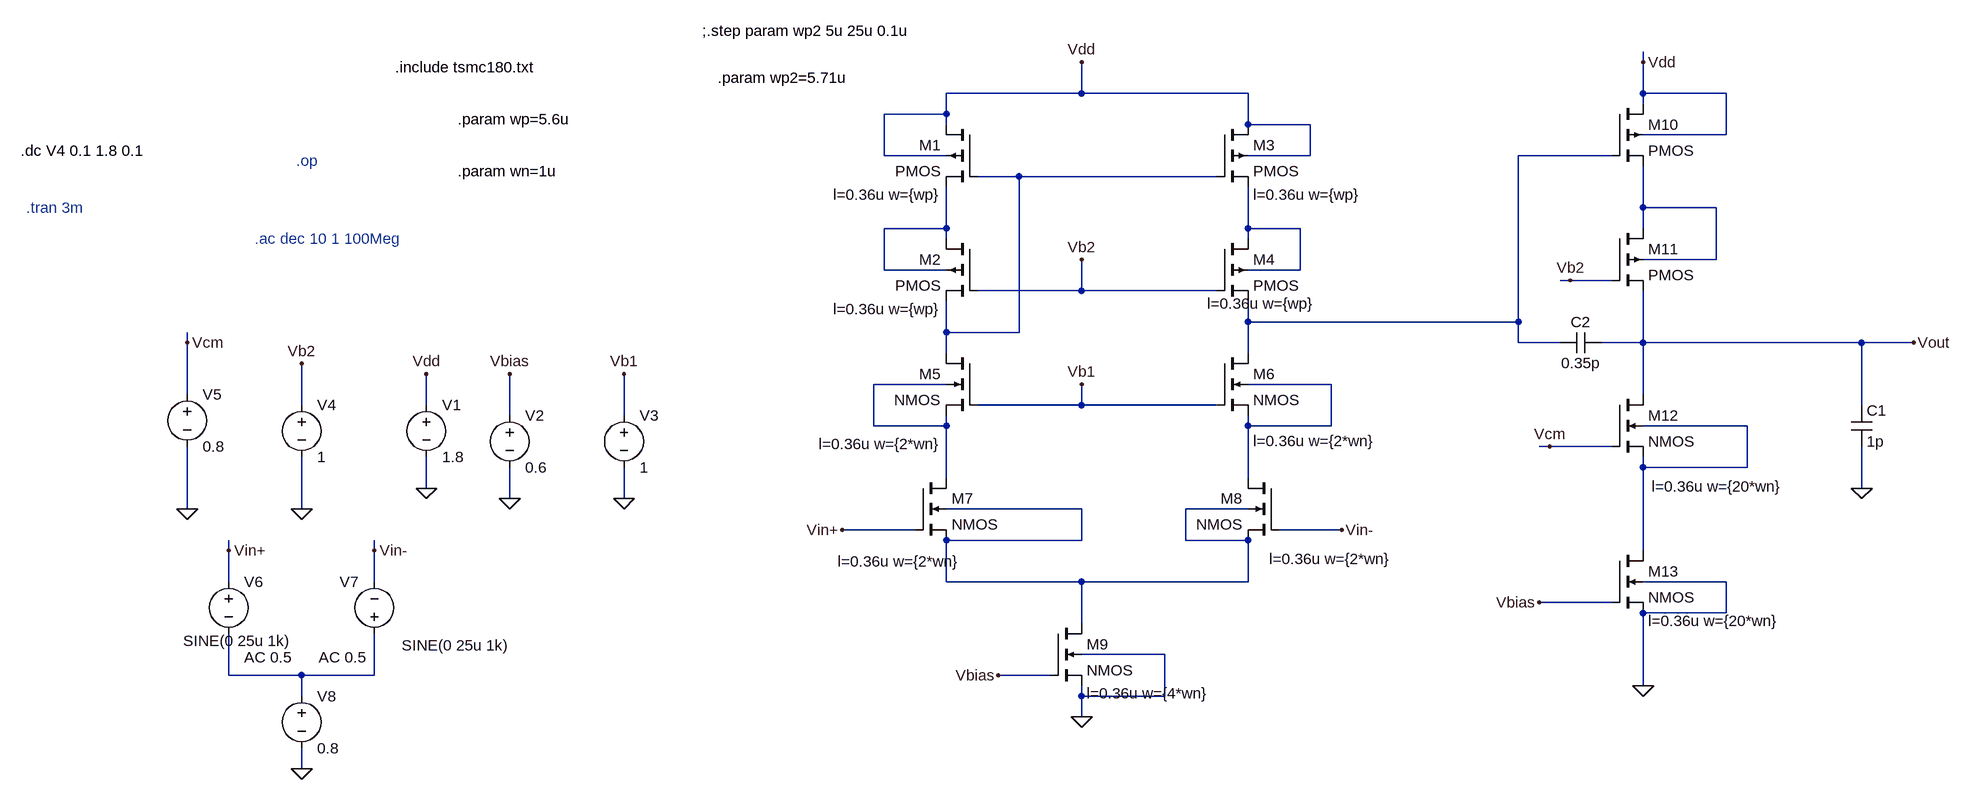
[diagram p0: schematic Fully differential telescopic cascode op-amp.asc]
Fully differential telescopic cascode op-amp.asc, the LTspice schematic file:
Version 4
SHEET 1 1580 680
WIRE 1072 -544 1072 -560
WIRE 208 -496 208 -544
WIRE 208 -496 0 -496
WIRE 464 -496 208 -496
WIRE 1072 -496 1072 -544
WIRE 1200 -496 1072 -496
WIRE 1072 -480 1072 -496
WIRE 0 -464 0 -496
WIRE 0 -464 -96 -464
WIRE 0 -448 0 -464
WIRE 464 -448 464 -496
WIRE 560 -448 464 -448
WIRE 1200 -432 1200 -496
WIRE 1200 -432 1072 -432
WIRE -96 -400 -96 -464
WIRE 0 -400 -96 -400
WIRE 560 -400 560 -448
WIRE 560 -400 464 -400
WIRE 1024 -400 880 -400
WIRE 112 -368 48 -368
WIRE 416 -368 112 -368
WIRE 1072 -320 1072 -384
WIRE 1184 -320 1072 -320
WIRE 0 -288 0 -352
WIRE 0 -288 -96 -288
WIRE 464 -288 464 -352
WIRE 544 -288 464 -288
WIRE 1072 -288 1072 -320
WIRE 0 -272 0 -288
WIRE 464 -272 464 -288
WIRE 1184 -240 1184 -320
WIRE 1184 -240 1072 -240
WIRE -96 -224 -96 -288
WIRE 0 -224 -96 -224
WIRE 544 -224 544 -288
WIRE 544 -224 464 -224
WIRE 960 -208 944 -208
WIRE 1024 -208 960 -208
WIRE 208 -192 208 -240
WIRE 208 -192 48 -192
WIRE 416 -192 208 -192
WIRE 464 -144 464 -176
WIRE 880 -144 880 -400
WIRE 880 -144 464 -144
WIRE 0 -128 0 -176
WIRE 112 -128 112 -368
WIRE 112 -128 0 -128
WIRE -1168 -112 -1168 -128
WIRE 880 -112 880 -144
WIRE 944 -112 880 -112
WIRE 1072 -112 1072 -192
WIRE 1072 -112 1008 -112
WIRE 1408 -112 1072 -112
WIRE 1488 -112 1408 -112
WIRE 0 -96 0 -128
WIRE 464 -96 464 -144
WIRE 0 -48 -112 -48
WIRE 592 -48 464 -48
WIRE -1168 -32 -1168 -112
WIRE 1072 -32 1072 -112
WIRE -992 -16 -992 -80
WIRE -800 -16 -800 -64
WIRE 208 -16 208 -48
WIRE 208 -16 48 -16
WIRE 416 -16 208 -16
WIRE 1408 -16 1408 -112
WIRE -672 0 -672 -64
WIRE -496 0 -496 -64
WIRE -112 16 -112 -48
WIRE 0 16 0 0
WIRE 0 16 -112 16
WIRE 464 16 464 0
WIRE 592 16 592 -48
WIRE 592 16 464 16
WIRE 1232 16 1072 16
WIRE 928 48 912 48
WIRE 1024 48 928 48
WIRE 1072 80 1072 64
WIRE 1232 80 1232 16
WIRE 1232 80 1072 80
WIRE 0 96 0 16
WIRE 464 96 464 16
WIRE -800 112 -800 64
WIRE 1408 112 1408 48
WIRE -672 128 -672 80
WIRE -496 128 -496 80
WIRE -1168 144 -1168 48
WIRE -992 144 -992 64
WIRE 208 144 0 144
WIRE 464 144 368 144
WIRE -48 176 -160 176
WIRE 608 176 512 176
WIRE 208 192 208 144
WIRE 208 192 0 192
WIRE 368 192 368 144
WIRE 464 192 368 192
WIRE -1104 208 -1104 192
WIRE -880 208 -880 192
WIRE 1072 208 1072 80
WIRE -1104 256 -1104 208
WIRE -880 256 -880 208
WIRE 0 256 0 192
WIRE 208 256 0 256
WIRE 464 256 464 192
WIRE 464 256 208 256
WIRE 1200 256 1072 256
WIRE 1024 288 912 288
WIRE 1200 304 1200 256
WIRE 1200 304 1072 304
WIRE 208 320 208 256
WIRE 336 368 208 368
WIRE -1104 400 -1104 336
WIRE -992 400 -1104 400
WIRE -880 400 -880 336
WIRE -880 400 -992 400
WIRE 160 400 80 400
WIRE 1072 416 1072 304
WIRE -992 432 -992 400
WIRE 208 432 208 416
WIRE 336 432 336 368
WIRE 336 432 208 432
WIRE 208 464 208 432
WIRE -992 544 -992 512
FLAG 208 464 0
FLAG 80 400 Vbias
FLAG -160 176 Vin+
FLAG 608 176 Vin-
FLAG 208 -544 Vdd
FLAG -672 128 0
FLAG -800 112 0
FLAG -800 -64 Vdd
FLAG -672 -64 Vbias
FLAG -496 128 0
FLAG -496 -64 Vb1
FLAG 208 -48 Vb1
FLAG -992 144 0
FLAG -992 -80 Vb2
FLAG 208 -240 Vb2
FLAG -1168 144 0
FLAG -1168 -112 Vcm
FLAG -992 544 0
FLAG -1104 208 Vin+
FLAG -880 208 Vin-
FLAG 1072 416 0
FLAG 912 288 Vbias
FLAG 1408 112 0
FLAG 1488 -112 Vout
FLAG 960 -208 Vb2
FLAG 1072 -544 Vdd
FLAG 928 48 Vcm
DATAFLAG 1184 -112 ""
DATAFLAG 736 -144 ""
SYMBOL pmos4 48 -448 M0
WINDOW 123 56 108 Left 2
SYMATTR Value2 l=0.36u w={wp}
SYMATTR InstName M1
SYMBOL pmos4 48 -272 M0
WINDOW 123 56 108 Left 2
SYMATTR Value2 l=0.36u w={wp}
SYMATTR InstName M2
SYMBOL pmos4 416 -448 R0
WINDOW 123 56 108 Left 2
SYMATTR Value2 l=0.36u w={wp}
SYMATTR InstName M3
SYMBOL pmos4 416 -272 R0
WINDOW 123 -15 100 Left 2
SYMATTR Value2 l=0.36u w={wp}
SYMATTR InstName M4
SYMBOL nmos4 48 -96 M0
WINDOW 123 56 140 Left 2
SYMATTR Value2 l=0.36u w={2*wn}
SYMATTR InstName M5
SYMBOL nmos4 416 -96 R0
WINDOW 123 56 135 Left 2
SYMATTR Value2 l=0.36u w={2*wn}
SYMATTR InstName M6
SYMBOL nmos4 -48 96 R0
WINDOW 123 -119 129 Left 2
SYMATTR Value2 l=0.36u w={2*wn}
SYMATTR InstName M7
SYMBOL nmos4 512 96 M0
WINDOW 123 -173 125 Left 2
SYMATTR Value2 l=0.36u w={2*wn}
SYMATTR InstName M8
SYMBOL nmos4 160 320 R0
WINDOW 123 56 108 Left 2
SYMATTR Value2 l=0.36u w={4*wn}
SYMATTR InstName M9
SYMBOL voltage -800 -32 R0
WINDOW 123 0 0 Left 0
WINDOW 39 0 0 Left 0
SYMATTR InstName V1
SYMATTR Value 1.8
SYMBOL voltage -672 -16 R0
WINDOW 123 0 0 Left 0
WINDOW 39 0 0 Left 0
SYMATTR InstName V2
SYMATTR Value 0.6
SYMBOL voltage -496 -16 R0
WINDOW 123 0 0 Left 0
WINDOW 39 0 0 Left 0
SYMATTR InstName V3
SYMATTR Value 1
SYMBOL voltage -992 -32 R0
WINDOW 123 0 0 Left 0
WINDOW 39 0 0 Left 0
SYMATTR InstName V4
SYMATTR Value 1
SYMBOL voltage -1168 -48 R0
WINDOW 123 0 0 Left 0
WINDOW 39 0 0 Left 0
SYMATTR InstName V5
SYMATTR Value 0.8
SYMBOL voltage -1104 240 R0
WINDOW 3 266 114 Left 2
WINDOW 123 24 132 Left 2
WINDOW 39 0 0 Left 0
SYMATTR Value SINE(0 25u 1k)
SYMATTR Value2 AC 0.5
SYMATTR InstName V6
SYMBOL voltage -880 352 R180
WINDOW 0 24 96 Left 2
WINDOW 3 129 5 Left 2
WINDOW 123 12 -20 Left 2
WINDOW 39 0 0 Left 0
SYMATTR InstName V7
SYMATTR Value SINE(0 25u 1k)
SYMATTR Value2 AC 0.5
SYMBOL voltage -992 416 R0
WINDOW 123 0 0 Left 0
WINDOW 39 0 0 Left 0
SYMATTR InstName V8
SYMATTR Value 0.8
SYMBOL pmos4 1024 -480 R0
SYMATTR InstName M10
SYMATTR Value2 l=0.36u w={wp2} m=10
SYMBOL pmos4 1024 -288 R0
SYMATTR InstName M11
SYMATTR Value2 l=0.36u w={wp2} m=10
SYMBOL nmos4 1024 -32 R0
WINDOW 123 61 141 Left 2
SYMATTR Value2 l=0.36u w={20*wn}
SYMATTR InstName M12
SYMBOL nmos4 1024 208 R0
WINDOW 123 56 108 Left 2
SYMATTR Value2 l=0.36u w={20*wn}
SYMATTR InstName M13
SYMBOL cap 1392 -16 R0
SYMATTR InstName C1
SYMATTR Value 1p
SYMBOL cap 1008 -128 R90
WINDOW 0 0 32 VBottom 2
WINDOW 3 32 32 VTop 2
SYMATTR InstName C2
SYMATTR Value 0.35p
TEXT -752 -456 Left 2 !.param wp=5.6u
TEXT -752 -376 Left 2 !.param wn=1u
TEXT -848 -536 Left 2 !.include tsmc180.txt
TEXT -1000 -392 Left 2 ;.op
TEXT -1064 -272 Left 2 ;.ac dec 10 1 100Meg
TEXT -1424 -408 Left 2 !.dc V4 0.1 1.8 0.1
TEXT -1416 -320 Left 2 ;.tran 3m
TEXT -376 -592 Left 2 !;.step param wp2 5u 25u 0.1u
TEXT -352 -520 Left 2 !.param wp2=5.71u

The netlist it stands for:
* Fully differential telescopic cascode op-amp.asc
M1 Vdd N002 N004 Vdd PMOS l=0.36u w={wp}
M2 N004 Vb2 N002 N004 PMOS l=0.36u w={wp}
M3 Vdd N002 N005 Vdd PMOS l=0.36u w={wp}
M4 N005 Vb2 N001 N005 PMOS l=0.36u w={wp}
M5 N002 Vb1 N006 N006 NMOS l=0.36u w={2*wn}
M6 N001 Vb1 N007 N007 NMOS l=0.36u w={2*wn}
M7 N006 Vin+ N009 N009 NMOS l=0.36u w={2*wn}
M8 N007 Vin- N009 N009 NMOS l=0.36u w={2*wn}
M9 N009 Vbias 0 0 NMOS l=0.36u w={4*wn}
V1 Vdd 0 1.8
V2 Vbias 0 0.6
V3 Vb1 0 1
V4 Vb2 0 1
V5 Vcm 0 0.8
V6 Vin+ N010 SINE(0 25u 1k) AC 0.5
V7 N010 Vin- SINE(0 25u 1k) AC 0.5
V8 N010 0 0.8
M10 Vdd N001 N003 Vdd PMOS l=0.36u w={wp2} m=10
M11 N003 Vb2 Vout N003 PMOS l=0.36u w={wp2} m=10
M12 Vout Vcm N008 N008 NMOS l=0.36u w={20*wn}
M13 N008 Vbias 0 0 NMOS l=0.36u w={20*wn}
C1 Vout 0 1p
C2 Vout N001 0.35p
.model NMOS NMOS
.model PMOS PMOS
.lib standard.mos
.param wp=5.6u
.param wn=1u
.include tsmc180.txt
* .op
* .ac dec 10 1 100Meg
.dc V4 0.1 1.8 0.1
* .tran 3m
;.step param wp2 5u 25u 0.1u
.param wp2=5.71u
.backanno
.end